# Altium schematic sheet bluetooth.SchDoc
size A4
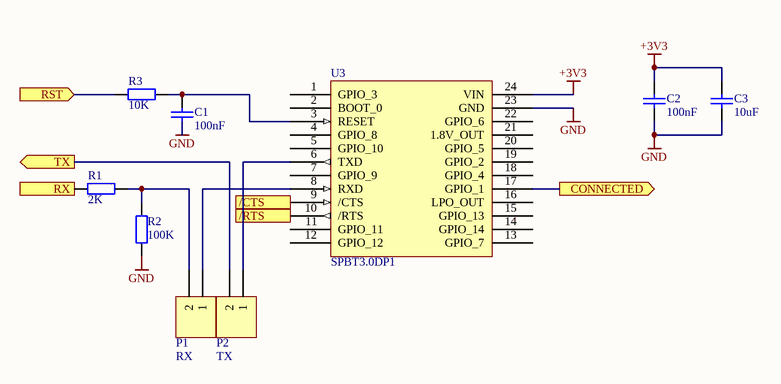
[diagram p0: bluetooth.SchDoc]

## Parts
C1  100nF  [FP_0805_CAP_085]
C2  100nF  [FP_0805_CAP_085]
C3  10uF  [FP_0805_CAP_085]
P1  RX  [HDR1X2]
P2  TX  [HDR1X2]
R1  2K  [FP_0805_RES]
R2  100K  [FP_0805_RES]
R3  10K  [FP_0805_RES]
U3  SPBT3.0DP1  [SPBT3.0DP1]

## Ports
/CTS (in), /RTS (out), CONNECTED (out), RST (in), RX (in), TX (out)

## Nets
+3V3: C2.2 C3.2 U3.24(VIN)
GND: C1.1 C2.1 C3.1 R2.1 U3.23(GND)
/CTS: U3.9(/CTS) ; port /CTS
/RTS: U3.10(/RTS) ; port /RTS
CONNECTED: U3.17(GPIO_1) ; port CONNECTED
RST: R3.1 ; port RST
RX: R1.1 ; port RX
TX: P2.2 ; port TX
NetC1_2: C1.2 R3.2 U3.3(RESET)
NetP1_1: P1.1 U3.8(RXD)
NetP1_2: P1.2 R1.2 R2.2
NetP2_1: P2.1 U3.6(TXD)

Not connected (* = marked no-connect by the designer): U3 1(GPIO_3) 2(BOOT_0) 4(GPIO_8) 5(GPIO_10) 7(GPIO_9) 11(GPIO_11) 12(GPIO_12) 13(GPIO_7) 14(GPIO_14) 15(GPIO_13) 16(LPO_OUT) 18(GPIO_4) 19(GPIO_2) 20(GPIO_5) 21(1.8V_OUT) 22(GPIO_6)

## Library data of the parts
C1-C3 = CAP: Capacitor
  C1 C2: Value: 100nF
  C3: Value: 10uF
P1 P2 = Header 2: Header, 2-Pin; LatestRevisionDate: 17-Jul-2002; LatestRevisionNote: Re-released for DXP Platform.; Publisher: Altium Limited
R1-R3 = RES: Resistor
  R1: Value: 2K
  R2: Value: 100K
  R3: Value: 10K
U3 = SPBT3.0DP1: Class 1 OEM Bluetooth 3.0 antenna module